# Altium schematic sheet Sheet2.SchDoc
size 420 x 297 mm; Address1: Address1; Address2: Address2; Address3: Address3; Address4: Address4; DocumentNumber: АБВГ.123456.001 Э3; SheetNumber: 1; Scale: 1:1; DocumentType: Схема электрическая принципиальная; FirstReferrence: АБВГ.123456.001
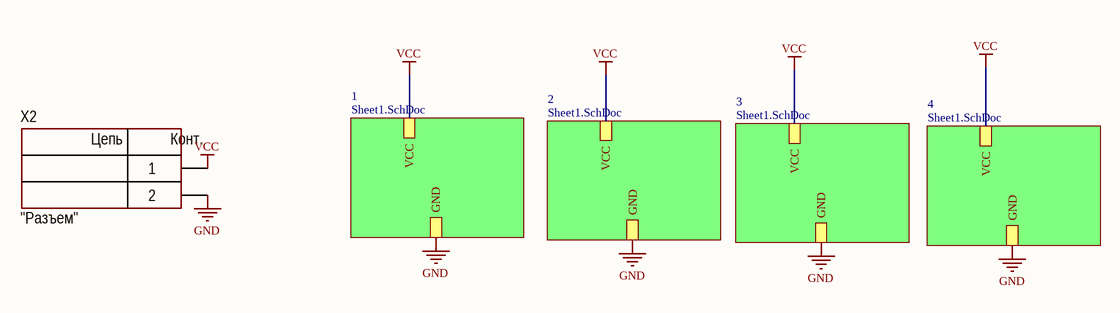
[diagram p0: Sheet2.SchDoc]

## Parts
X2  CommentText: "Разъем"  [CON: KF301-5.0-2P]

## Sub-sheets
1 = Sheet1.SchDoc: GND, VCC
2 = Sheet1.SchDoc: GND, VCC
3 = Sheet1.SchDoc: GND, VCC
4 = Sheet1.SchDoc: GND, VCC

## Nets
GND: X2.2 ; sheet 1/GND, sheet 2/GND, sheet 3/GND, sheet 4/GND
VCC: X2.1 ; sheet 1/VCC, sheet 2/VCC, sheet 3/VCC, sheet 4/VCC

## Notes on the sheet
- Перв. примен.
- Справ. №
- Подп. и дата
- Инв. № дубл.
- Взам. инв. №
- Разраб.
- Изм.
- Лист
- № докум.
- Подп.
- Дата
- Лит.
- Масса
- Масштаб
- Пров.
- Т.контр.
- Листов
- Инв. № подл.
- Утв.
- Н.контр.
- 2.106-A3
- Копировал
- Формат А3
- (in symbol Connector_terminal_2pin) Цепь; Конт.

## Library data of the parts
X2 = Connector_terminal_2pin: Manufacturer: Degson; ValueManufacturerPartNumber: Terminal connector, 2pin, 3.5mm, 300VAC, 10A; PartNumber: DG350-3.5-02P-14; TypeConnector: Terminal connector; VoltageMax: 300VAC; Pitch: 3.5mm; CurrentMax: 10A; Multichannel: 2pin; HelpURL: https://www.chipdip.ru/product/dg350-3.5-02p-12